# Altium project MAX30205_Adapter.PrjPcb
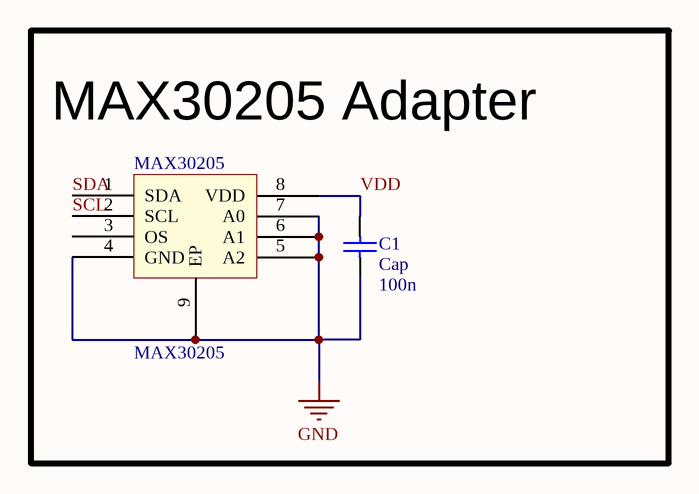
[diagram p0: Adapter.SchDoc]
1 sheet, 2 parts. Net scope: global (net labels, ports and power ports of the same name join across sheets).
Board file: Adapter.PcbDoc

## Sheet Adapter.SchDoc
size A4

### Parts
C1  Cap  value 100n  [0603 Cap]
MAX30206  MAX30205  [MAX30205]

### Blocks framed on the sheet
MAX30205 Adapter: C1 MAX30206

### Nets
GND: C1.1 MAX30206.4(GND) MAX30206.5(A2) MAX30206.6(A1) MAX30206.7(A0) MAX30206.9(EP)
SCL: MAX30206.2(SCL)
SDA: MAX30206.1(SDA)
VDD: C1.2 MAX30206.8(VDD)

Not connected (* = marked no-connect by the designer): MAX30206 3(OS)

### Library data of the parts
MAX30206 = MAX30205: Supplier 1: Farnell; Supplier Part Number 1: MAX30205